# Altium schematic sheet MS3100_MCU_V0.1.SchDoc
size A3
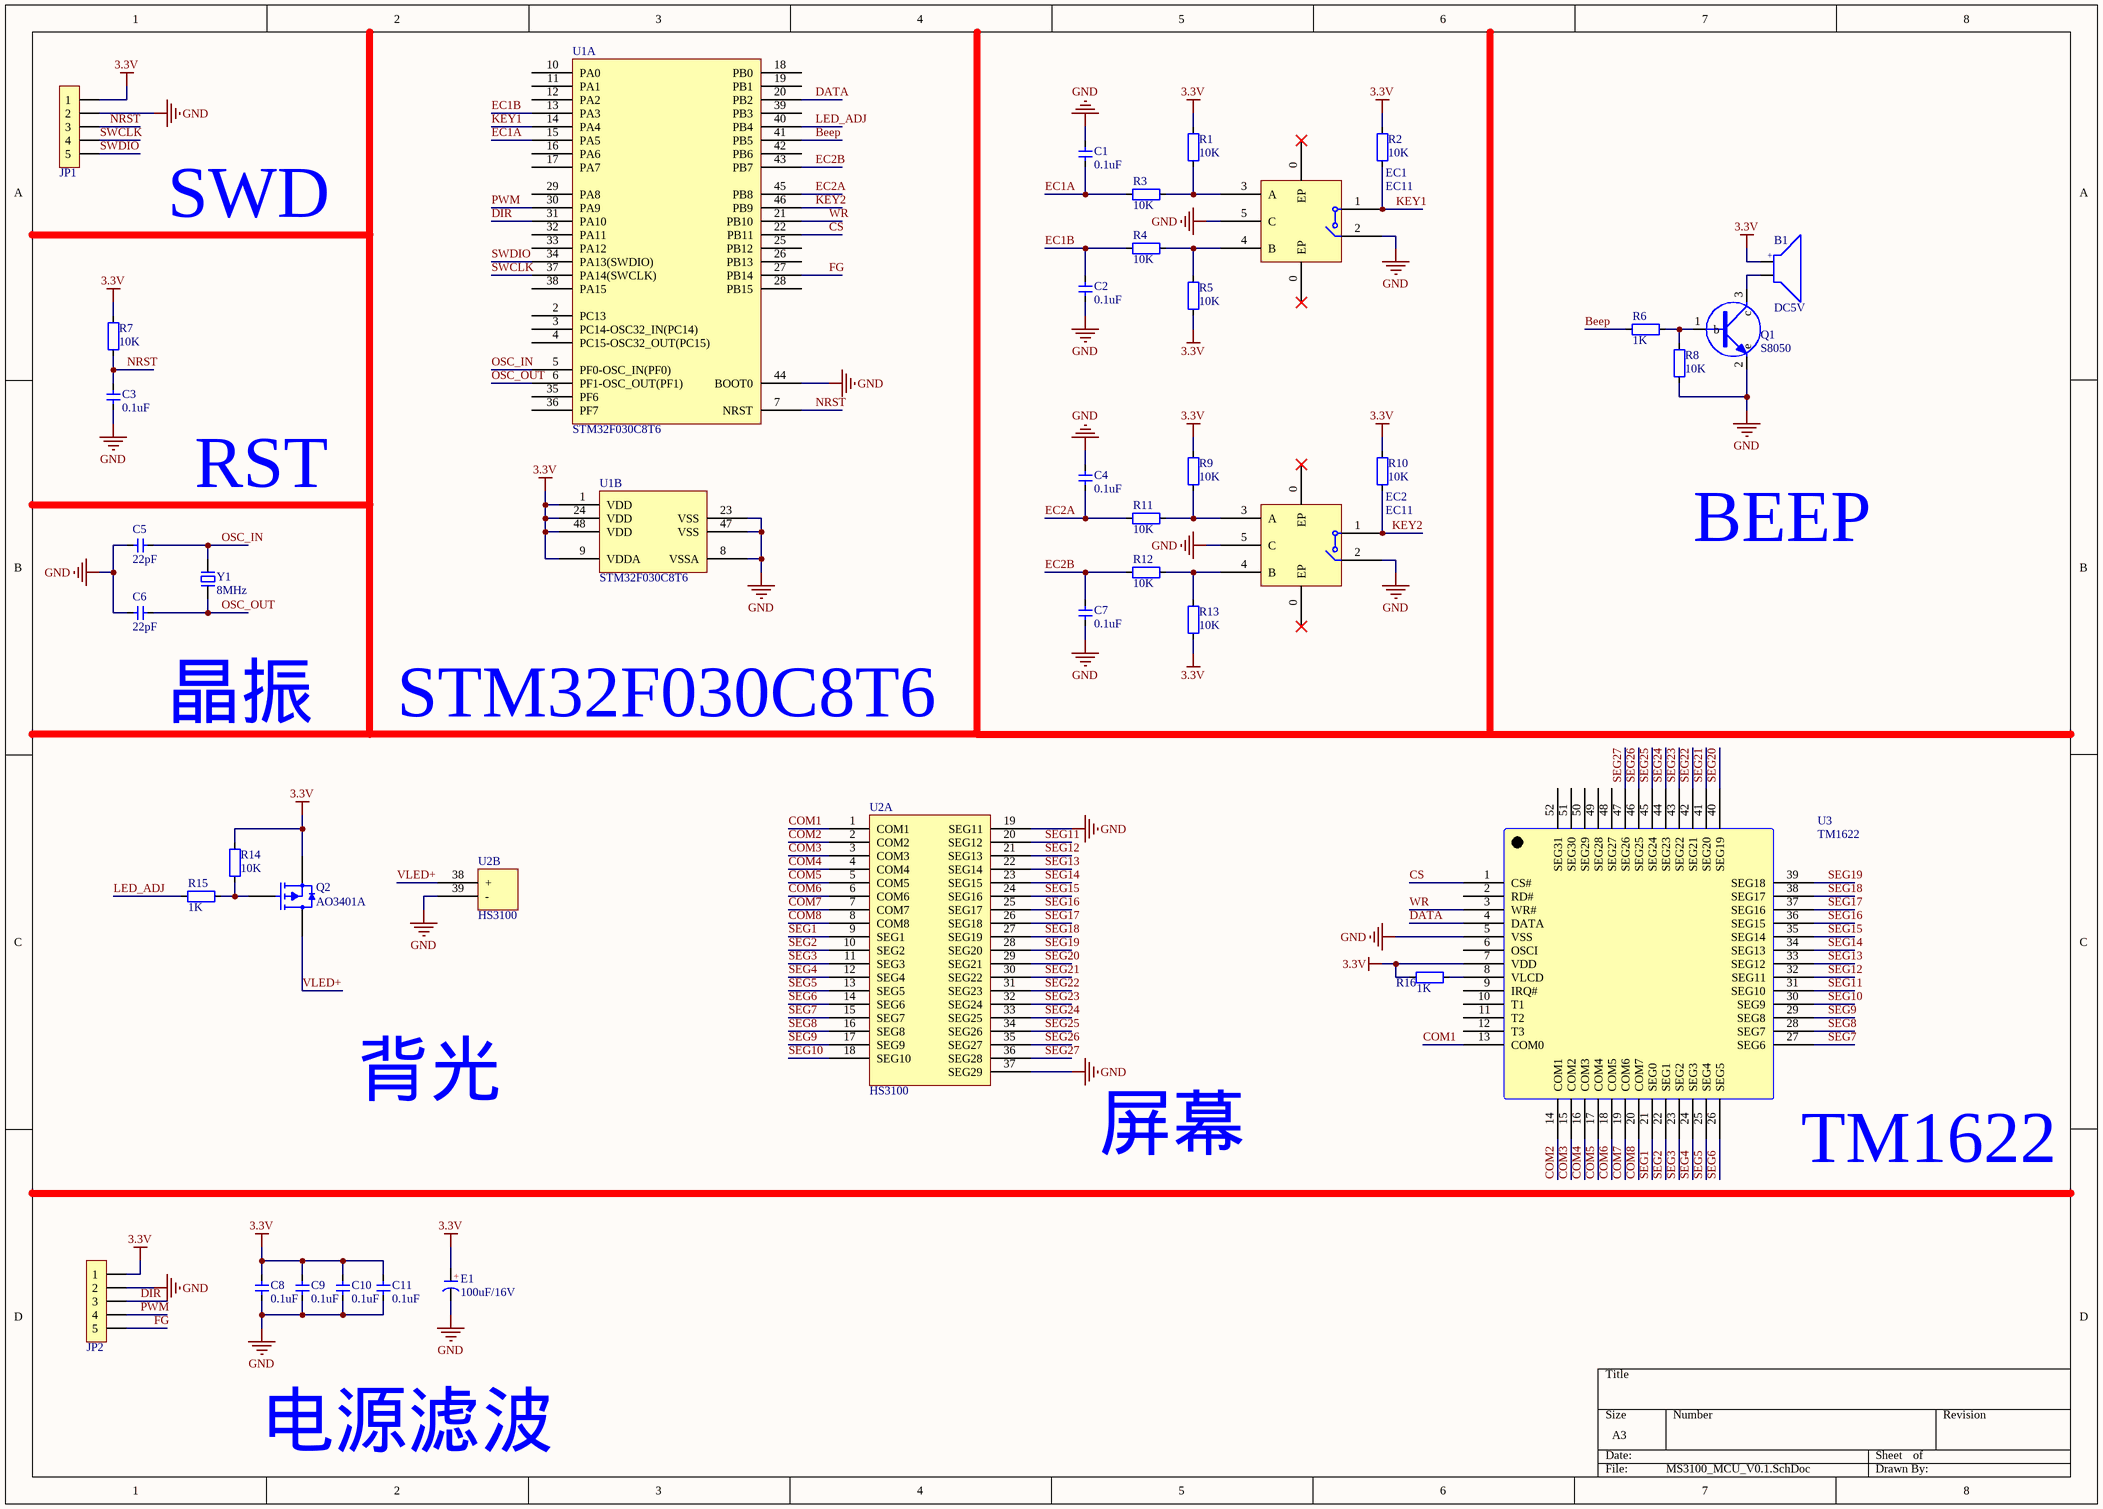
[diagram p0: MS3100_MCU_V0.1.SchDoc]

## Parts
B1  DC5V  [BEEP 7.6X12X7.5]
C1  0.1uF  [C 0603]
C2  0.1uF  [C 0603]
C3  0.1uF  [C 0603]
C4  0.1uF  [C 0603]
C5  22pF  [C 0603]
C6  22pF  [C 0603]
C7  0.1uF  [C 0603]
C8  0.1uF  [C 0603]
C9  0.1uF  [C 0603]
C10  0.1uF  [C 0603]
C11  0.1uF  [C 0603]
E1  100uF/16V  [CAP 2.0*5*11 - BK]
EC1  EC11  [EC11A]
EC2  EC11  [EC11A]
JP1  HDR-1X5  [SWD_JOANLAB]  (value not drawn)
JP2  HDR-1X5  [XH2.54-5P]  (value not drawn)
Q1  S8050  [SOT23-3L]
Q2  AO3401A  [SOT23-3]
R1  10K  [R 0603]
R2  10K  [R 0603]
R3  10K  [R 0603]
R4  10K  [R 0603]
R5  10K  [R 0603]
R6  1K  [R 0603]
R7  10K  [R 0603]
R8  10K  [R 0603]
R9  10K  [R 0603]
R10  10K  [R 0603]
R11  10K  [R 0603]
R12  10K  [R 0603]
R13  10K  [R 0603]
R14  10K  [R 0603]
R15  1K  [R 0603]
R16  1K  [R 0603]
U1  STM32F030C8T6  [STM32F030C8T6]  (parts A,B of 2)
U2  HS3100  [HS3100]  (parts A,B of 2)
U3  TM1622  [TM1622]
Y1  8MHz  [XTAL-49S SMD]

## Nets
3.3V: B1.1 C8.2 C9.2 C10.2 C11.2 E1.1(A) JP1.1 JP2.1 Q2.2(S) R1.2 R2.2 R5.1 R7.2 R9.2 R10.2 R13.1 R14.2 R16.1 U1.1(VDD) U1.9(VDDA) U1.24(VDD) U1.48(VDD) U3.7(VDD)
GND: C1.2 C2.1 C3.1 C4.2 C5.1 C6.1 C7.1 C8.1 C9.1 C10.1 C11.1 E1.2(K) EC1.2 EC1.5(C) EC2.2 EC2.5(C) JP1.2 JP2.2 Q1.2(e) R8.1 U1.8(VSSA) U1.23(VSS) U1.44(BOOT0) U1.47(VSS) U2.19(SEG11) U2.37(SEG29) U2.39(-) U3.5(VSS)
Beep: R6.1 U1.41(PB5)
COM1: U2.1(COM1) U3.13(COM0)
COM2: U2.2(COM2) U3.14(COM1)
COM3: U2.3(COM3) U3.15(COM2)
COM4: U2.4(COM4) U3.16(COM3)
COM5: U2.5(COM5) U3.17(COM4)
COM6: U2.6(COM6) U3.18(COM5)
COM7: U2.7(COM7) U3.19(COM6)
COM8: U2.8(COM8) U3.20(COM7)
CS: U1.22(PB11) U3.1(CS#)
DATA: U1.20(PB2) U3.4(DATA)
DIR: JP2.3 U1.31(PA10)
EC1A: C1.1 R3.1 U1.15(PA5)
EC1B: C2.2 R4.1 U1.13(PA3)
EC2A: C4.1 R11.1 U1.45(PB8)
EC2B: C7.2 R12.1 U1.43(PB7)
FG: JP2.5 U1.27(PB14)
KEY1: EC1.1 R2.1 U1.14(PA4)
KEY2: EC2.1 R10.1 U1.46(PB9)
LED_ADJ: R15.1 U1.40(PB4)
NRST: C3.2 JP1.3 R7.1 U1.7(NRST)
OSC_IN: C5.2 U1.5(PF0-OSC_IN(PF0)) Y1.2
OSC_OUT: C6.2 U1.6(PF1-OSC_OUT(PF1)) Y1.1
PWM: JP2.4 U1.30(PA9)
SEG1: U2.9(SEG1) U3.21(SEG0)
SEG2: U2.10(SEG2) U3.22(SEG1)
SEG3: U2.11(SEG3) U3.23(SEG2)
SEG4: U2.12(SEG4) U3.24(SEG3)
SEG5: U2.13(SEG5) U3.25(SEG4)
SEG6: U2.14(SEG6) U3.26(SEG5)
SEG7: U2.15(SEG7) U3.27(SEG6)
SEG8: U2.16(SEG8) U3.28(SEG7)
SEG9: U2.17(SEG9) U3.29(SEG8)
SEG10: U2.18(SEG10) U3.30(SEG9)
SEG11: U2.20(SEG12) U3.31(SEG10)
SEG12: U2.21(SEG13) U3.32(SEG11)
SEG13: U2.22(SEG14) U3.33(SEG12)
SEG14: U2.23(SEG15) U3.34(SEG13)
SEG15: U2.24(SEG16) U3.35(SEG14)
SEG16: U2.25(SEG17) U3.36(SEG15)
SEG17: U2.26(SEG18) U3.37(SEG16)
SEG18: U2.27(SEG19) U3.38(SEG17)
SEG19: U2.28(SEG20) U3.39(SEG18)
SEG20: U2.29(SEG21) U3.40(SEG19)
SEG21: U2.30(SEG22) U3.41(SEG20)
SEG22: U2.31(SEG23) U3.42(SEG21)
SEG23: U2.32(SEG24) U3.43(SEG22)
SEG24: U2.33(SEG25) U3.44(SEG23)
SEG25: U2.34(SEG26) U3.45(SEG24)
SEG26: U2.35(SEG27) U3.46(SEG25)
SEG27: U2.36(SEG28) U3.47(SEG26)
SWCLK: JP1.4 U1.37(PA14(SWCLK))
SWDIO: JP1.5 U1.34(PA13(SWDIO))
VLED+: Q2.3(D) U2.38(+)
WR: U1.21(PB10) U3.3(WR#)
NetB1_2: B1.2 Q1.3(c)
NetEC1_3: EC1.3(A) R1.1 R3.2
NetEC1_4: EC1.4(B) R4.2 R5.2
NetEC2_3: EC2.3(A) R9.1 R11.2
NetEC2_4: EC2.4(B) R12.2 R13.2
NetQ1_1: Q1.1(b) R6.2 R8.2
NetQ2_1: Q2.1(G) R14.1 R15.2
NetR16_2: R16.2 U3.8(VLCD)

Not connected (* = marked no-connect by the designer): EC1 0(EP)*; EC2 0(EP)*; U1 2(PC13) 3(PC14-OSC32_IN(PC14)) 4(PC15-OSC32_OUT(PC15)) 10(PA0) 11(PA1) 12(PA2) 16(PA6) 17(PA7) 18(PB0) 19(PB1) 25(PB12) 26(PB13) 28(PB15) 29(PA8) 32(PA11) 33(PA12) 35(PF6) 36(PF7) 38(PA15) 39(PB3) 42(PB6); U3 2(RD#) 6(OSCI) 9(IRQ#) 10(T1) 11(T2) 12(T3) 48(SEG27) 49(SEG28) 50(SEG29) 51(SEG30) 52(SEG31)

## Notes on the sheet
- SWD
- RST
- BEEP
- 晶振
- STM32F030C8T6
- 背光
- 屏幕
- (near U3) TM1622
- 电源滤波
- (in symbol BEEP) +
- (in symbol C-CAP) +

## Library data of the parts
B1 = BEEP: 蜂鸣器; 版权归属: 源创客; BOM名称: 蜂鸣器; 学习资源: www.ooocke.com
C1-C11 = C: 无极性贴片电容; 版权归属: 源创客; BOM名称: 无极性贴片电容; 学习资源: www.ooocke.com
E1 = C-CAP: 直插电解电容; 版权归属: 源创客; BOM名称: 直插电解电容; 学习资源: www.ooocke.com
EC1 EC2 = EC11: 旋钮电位器
JP1 JP2 = Header 5: 5P接插件; 版权归属: 源创客; BOM名称: 5P接插件; 学习资源: www.ooocke.com
Q1 = NPN
Q2 = AO3401A: P-MOS
R1-R16 = R: 贴片电阻; 版权归属: 源创客; BOM名称: 贴片电阻; 学习资源: www.ooocke.com
U1 = STM32F030C8T6: STM32F030采用ARM Cortex内核，运算速度高达48 MHz。STM32F030是STM32系列中价格最低的产品，具有全套外设，例如高速12位ADC、先进且灵活的定时器、日历RTC和通信接口（例如 I?C、USART和SPI）。
U2 = HS3100: HS3100的屏幕
U3 = TM1622: LCD驱动芯片，52脚
Y1 = XTAL-2: 2脚晶振; 版权归属: 源创客; BOM名称: 2脚晶振; 学习资源: www.ooocke.com